# Altium schematic sheet Sheet2.SchDoc
size A4
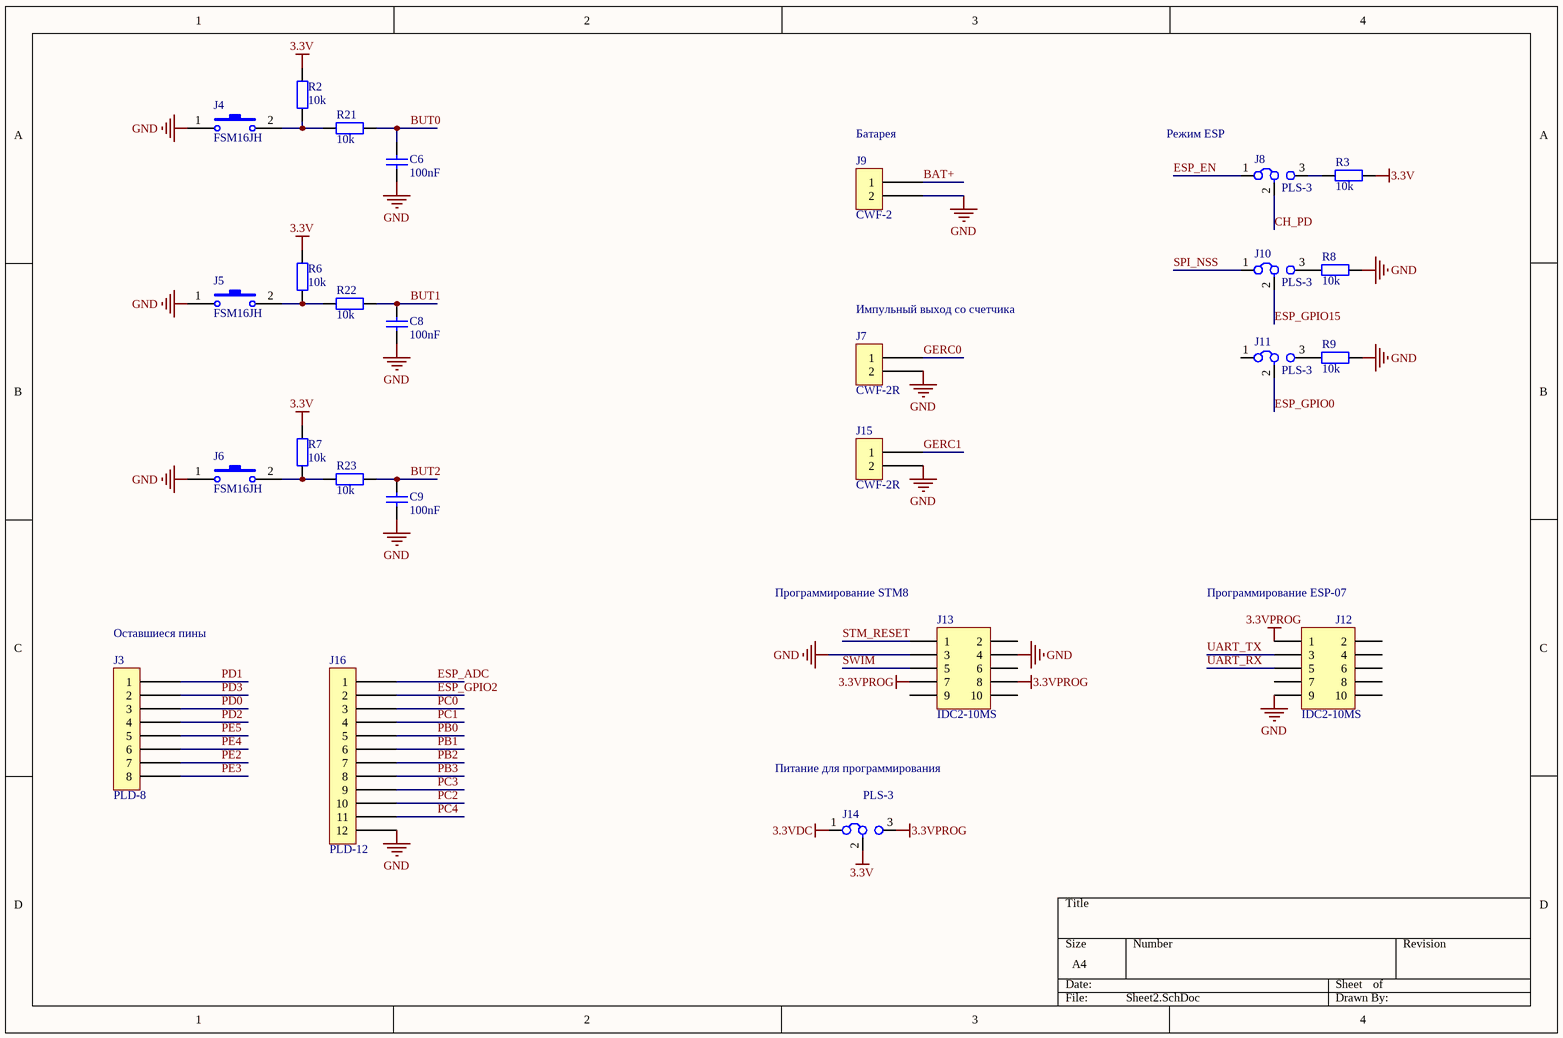
[diagram p0: Sheet2.SchDoc]

## Parts
C6  value 100nF  [0603(CAPC1608X09N)]  (hidden comment: Capacitor)
C8  value 100nF  [0603(CAPC1608X09N)]  (hidden comment: Capacitor)
C9  value 100nF  [0603(CAPC1608X09N)]  (hidden comment: Capacitor)
J3  PLD-8  [PLD-8]
J4  FSM16JH  [FSM16JH]
J5  FSM16JH  [FSM16JH]
J6  FSM16JH  [FSM16JH]
J7  CWF-2R  [DS1069-2MRW6XB]
J8  PLS-3  [PLS-3]
J9  CWF-2  [DS1069-2MVW6X]
J10  PLS-3  [PLS-3]
J11  PLS-3  [PLS-3]
J12  IDC2-10MS  [IDC2-10MS]
J13  IDC2-10MS  [IDC2-10MS]
J14  PLS-3  [PLS-3]
J15  CWF-2R  [DS1069-2MRW6XB]
J16  PLD-12  [PLD-12]
R2  value 10k  [0603(RESC1608X05N)]  (hidden comment: Resistor)
R3  value 10k  [0603(RESC1608X05N)]  (hidden comment: Resistor)
R6  value 10k  [0603(RESC1608X05N)]  (hidden comment: Resistor)
R7  value 10k  [0603(RESC1608X05N)]  (hidden comment: Resistor)
R8  value 10k  [0603(RESC1608X05N)]  (hidden comment: Resistor)
R9  value 10k  [0603(RESC1608X05N)]  (hidden comment: Resistor)
R21  value 10k  [0603(RESC1608X05N)]  (hidden comment: Resistor)
R22  value 10k  [0603(RESC1608X05N)]  (hidden comment: Resistor)
R23  value 10k  [0603(RESC1608X05N)]  (hidden comment: Resistor)

## Nets
3.3V: J14.2 R2.2 R3.2 R6.2 R7.2
3.3VDC: J14.1
3.3VPROG: J12.1 J13.7 J13.8 J14.3
GND: C6.1 C8.1 C9.1 J4.1(COMMON1) J5.1(COMMON1) J6.1(COMMON1) J7.2 J9.2 J12.9 J13.3 J13.4 J15.2 J16.12 R8.2 R9.2
BAT+: J9.1
BUT0: C6.2 R21.2
BUT1: C8.2 R22.2
BUT2: C9.2 R23.2
CH_PD: J8.2
ESP_ADC: J16.1
ESP_EN: J8.1
ESP_GPIO0: J11.2
ESP_GPIO2: J16.2
ESP_GPIO15: J10.2
GERC0: J7.1
GERC1: J15.1
PB0: J16.5
PB1: J16.6
PB2: J16.7
PB3: J16.8
PC0: J16.3
PC1: J16.4
PC2: J16.10
PC3: J16.9
PC4: J16.11
PD0: J3.3
PD1: J3.1
PD2: J3.4
PD3: J3.2
PE2: J3.7
PE3: J3.8
PE4: J3.6
PE5: J3.5
SPI_NSS: J10.1
STM_RESET: J13.1
SWIM: J13.5
UART_RX: J12.5
UART_TX: J12.3
NetJ4_2: J4.2(NO1) R2.1 R21.1
NetJ5_2: J5.2(NO1) R6.1 R22.1
NetJ6_2: J6.2(NO1) R7.1 R23.1
NetJ8_3: J8.3 R3.1
NetJ10_3: J10.3 R8.1
NetJ11_3: J11.3 R9.1

Not connected (* = marked no-connect by the designer): J11 1; J12 2 4 6 7 8 10; J13 2 6 9 10

## Notes on the sheet
- (near J9) Батарея
- (near J8) Режим ESP
- (near J7) Импульный выход со счетчика
- (near J3) Оставшиеся пины
- (near J13) Программирование STM8
- (near J12) Программирование ESP-07
- Питание для программирования

## Library data of the parts
C6 C8 C9 = Capacitor: Name: Конденсатор керамический SMD
J3 = PLD-8: Вилка штыревая PLD-8, прямая; Manufacturer: Connfly; Model: PLD-8
J4-J6 = Tact switch: Model: FSM16JH
J7 J15 = CWF-2R: Вилка на плату CWF-2R, угловая; Manufacturer: Connfly; Model: DS1069-2MRW6XB; Part number: DS1069-2MRW6XB
J8 J10 J11 J14 = PLS-3: Вилка штыревая PLS-3, прямая; Name: Вилка штыревая PLS-3, прямая
J9 = CWF-2: Вилка на плату CWF-2, прямая; Manufacturer: Connfly; Model: DS1069-2MVW6X; Part number: DS1069-2MVW6X
J12 J13 = IDC2-10MS: Вилка на плату IDC2-10MS, прямая; Name: Вилка на плату IDC2-10MS, прямая
J16 = PLD-12: Вилка штыревая PLD-12, прямая; Manufacturer: Connfly; Model: PLD-12
R2 R3 R6-R9 R21-R23 = Resistor: Name: Резистор SMD